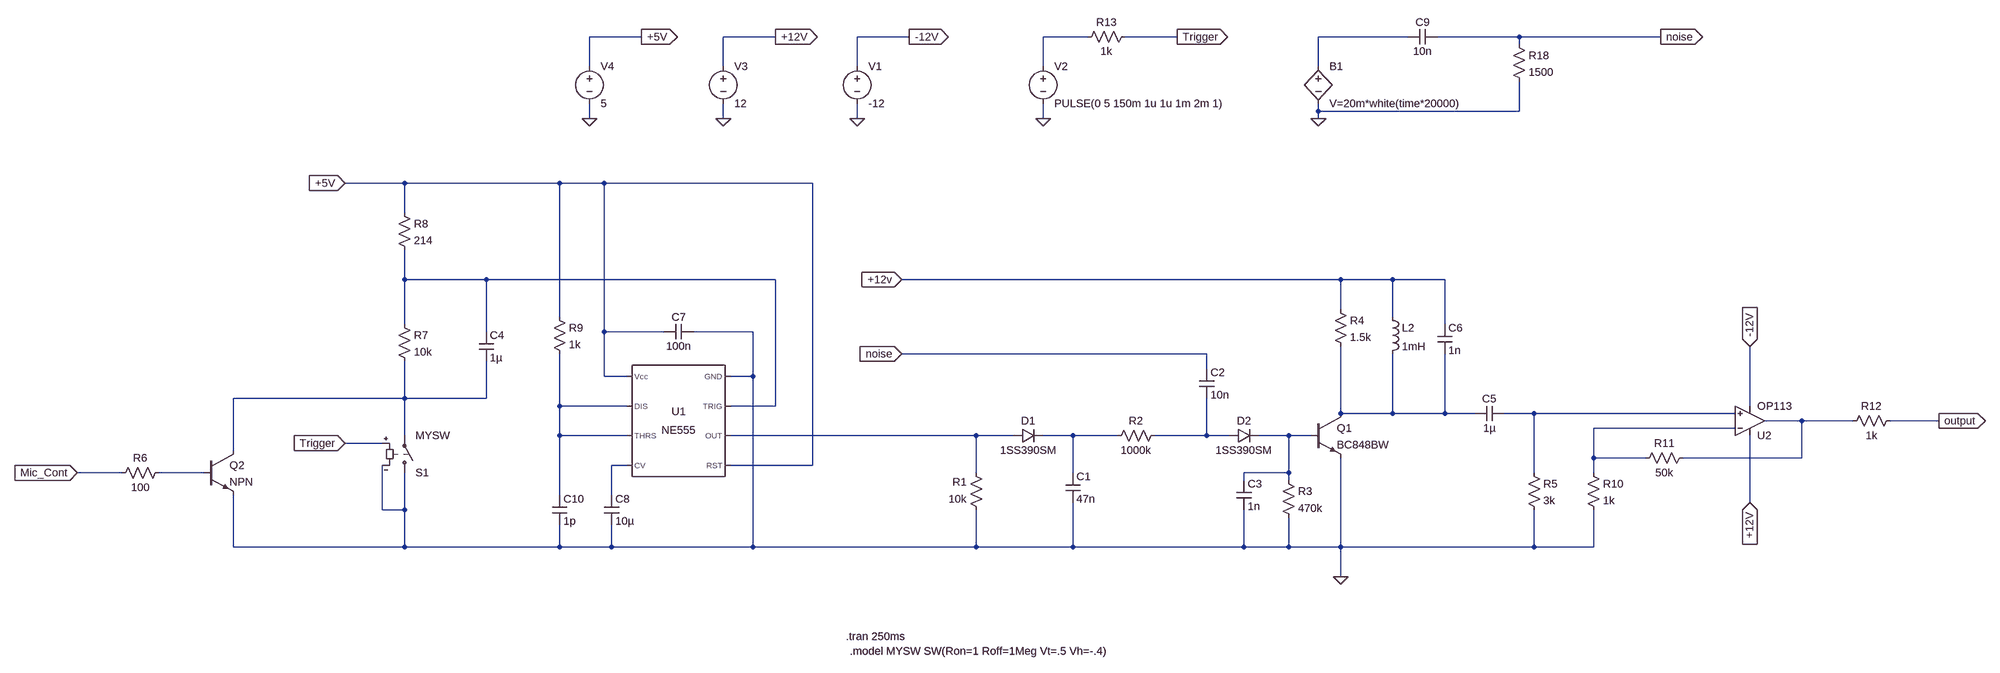
[diagram p0: schematic Platine_2.asc]
Platine_2.asc, the LTspice schematic file:
Version 4
SHEET 1 3160 680
WIRE 192 -1152 80 -1152
WIRE 480 -1152 368 -1152
WIRE 768 -1152 656 -1152
WIRE 1152 -1152 1056 -1152
WIRE 1344 -1152 1232 -1152
WIRE 1840 -1152 1648 -1152
WIRE 2080 -1152 1904 -1152
WIRE 2384 -1152 2080 -1152
WIRE 2080 -1136 2080 -1152
WIRE 80 -1088 80 -1152
WIRE 368 -1088 368 -1152
WIRE 656 -1088 656 -1152
WIRE 1056 -1088 1056 -1152
WIRE 1648 -1088 1648 -1152
WIRE 1648 -992 1648 -1008
WIRE 2080 -992 2080 -1056
WIRE 2080 -992 1648 -992
WIRE 80 -976 80 -1008
WIRE 368 -976 368 -1008
WIRE 656 -976 656 -1008
WIRE 1056 -976 1056 -1008
WIRE 1648 -976 1648 -992
WIRE -336 -672 -464 -672
WIRE 16 -672 -336 -672
WIRE 112 -672 16 -672
WIRE 560 -672 112 -672
WIRE -336 -608 -336 -672
WIRE -336 -464 -336 -528
WIRE -160 -464 -336 -464
WIRE 480 -464 -160 -464
WIRE 1696 -464 752 -464
WIRE 1808 -464 1696 -464
WIRE 1920 -464 1808 -464
WIRE 1696 -400 1696 -464
WIRE 16 -384 16 -672
WIRE 1808 -384 1808 -464
WIRE -336 -368 -336 -464
WIRE 1920 -368 1920 -464
WIRE -160 -352 -160 -464
WIRE 112 -352 112 -672
WIRE 240 -352 112 -352
WIRE 432 -352 304 -352
WIRE 1408 -304 752 -304
WIRE 1408 -272 1408 -304
WIRE 112 -256 112 -352
WIRE 160 -256 112 -256
WIRE 432 -256 432 -352
WIRE 432 -256 384 -256
WIRE -336 -208 -336 -288
WIRE -336 -208 -704 -208
WIRE -160 -208 -160 -288
WIRE -160 -208 -336 -208
WIRE 16 -192 16 -304
WIRE 160 -192 16 -192
WIRE 480 -192 480 -464
WIRE 480 -192 384 -192
WIRE 2576 -192 2576 -320
WIRE 1696 -176 1696 -320
WIRE 1808 -176 1808 -304
WIRE 1808 -176 1696 -176
WIRE 1920 -176 1920 -304
WIRE 1920 -176 1808 -176
WIRE 1984 -176 1920 -176
WIRE 2112 -176 2048 -176
WIRE 2544 -176 2112 -176
WIRE 2688 -160 2608 -160
WIRE 2816 -160 2688 -160
WIRE 3024 -160 2896 -160
WIRE 2544 -144 2240 -144
WIRE -336 -128 -336 -208
WIRE 16 -128 16 -192
WIRE 160 -128 16 -128
WIRE 912 -128 384 -128
WIRE 992 -128 912 -128
WIRE 1120 -128 1056 -128
WIRE 1216 -128 1120 -128
WIRE 1408 -128 1408 -208
WIRE 1408 -128 1296 -128
WIRE 1456 -128 1408 -128
WIRE 1584 -128 1520 -128
WIRE 1632 -128 1584 -128
WIRE -384 -112 -464 -112
WIRE -704 -96 -704 -208
WIRE 2240 -80 2240 -144
WIRE 2352 -80 2240 -80
WIRE 2688 -80 2688 -160
WIRE 2688 -80 2432 -80
WIRE 160 -64 128 -64
WIRE 560 -64 560 -672
WIRE 560 -64 384 -64
WIRE -944 -48 -1040 -48
WIRE -768 -48 -864 -48
WIRE 912 -48 912 -128
WIRE 1120 -48 1120 -128
WIRE 1584 -48 1584 -128
WIRE 1584 -48 1488 -48
WIRE 2112 -48 2112 -176
WIRE 2240 -48 2240 -80
WIRE 1488 -32 1488 -48
WIRE 1584 -32 1584 -48
WIRE 16 0 16 -128
WIRE 128 0 128 -64
WIRE 2576 16 2576 -128
WIRE -384 32 -384 -64
WIRE -336 32 -336 -48
WIRE -336 32 -384 32
WIRE -704 112 -704 0
WIRE -336 112 -336 32
WIRE -336 112 -704 112
WIRE 16 112 16 64
WIRE 16 112 -336 112
WIRE 128 112 128 64
WIRE 128 112 16 112
WIRE 432 112 432 -256
WIRE 432 112 128 112
WIRE 912 112 912 32
WIRE 912 112 432 112
WIRE 1120 112 1120 16
WIRE 1120 112 912 112
WIRE 1488 112 1488 32
WIRE 1488 112 1120 112
WIRE 1584 112 1584 48
WIRE 1584 112 1488 112
WIRE 1696 112 1696 -80
WIRE 1696 112 1584 112
WIRE 2112 112 2112 32
WIRE 2112 112 1696 112
WIRE 2240 112 2240 32
WIRE 2240 112 2112 112
WIRE 1696 176 1696 112
FLAG 768 -1152 -12V
IOPIN 768 -1152 Out
FLAG 656 -976 0
FLAG 1344 -1152 Trigger
IOPIN 1344 -1152 Out
FLAG 1056 -976 0
FLAG 752 -464 +12v
IOPIN 752 -464 In
FLAG 3024 -160 output
IOPIN 3024 -160 Out
FLAG 1648 -976 0
FLAG 2384 -1152 noise
IOPIN 2384 -1152 Out
FLAG 1696 176 0
FLAG 752 -304 noise
IOPIN 752 -304 In
FLAG -1040 -48 Mic_Cont
IOPIN -1040 -48 In
FLAG -464 -112 Trigger
IOPIN -464 -112 In
FLAG -464 -672 +5V
IOPIN -464 -672 In
FLAG 480 -1152 +12V
IOPIN 480 -1152 Out
FLAG 368 -976 0
FLAG 192 -1152 +5V
IOPIN 192 -1152 Out
FLAG 80 -976 0
FLAG 2576 -320 -12V
IOPIN 2576 -320 In
FLAG 2576 16 +12V
IOPIN 2576 16 In
SYMBOL voltage 656 -1104 R0
WINDOW 123 0 0 Left 0
WINDOW 39 0 0 Left 0
SYMATTR InstName V1
SYMATTR Value -12
SYMBOL voltage 1056 -1104 R0
WINDOW 123 0 0 Left 0
WINDOW 39 0 0 Left 0
SYMATTR InstName V2
SYMATTR Value PULSE(0 5 150m 1u 1u 1m 2m 1)
SYMBOL bv 1648 -1104 R0
SYMATTR InstName B1
SYMATTR Value V=20m*white(time*20000)
SYMBOL cap 1904 -1168 R90
WINDOW 0 0 32 VBottom 2
WINDOW 3 32 32 VTop 2
SYMATTR InstName C9
SYMATTR Value 10n
SYMBOL res 2064 -1152 R0
SYMATTR InstName R18
SYMATTR Value 1500
SYMBOL res 928 48 R180
WINDOW 0 36 76 Left 2
WINDOW 3 36 40 Left 2
SYMATTR InstName R1
SYMATTR Value 10k
SYMBOL diode 992 -112 R270
WINDOW 0 32 32 VTop 2
WINDOW 3 0 32 VBottom 2
SYMATTR InstName D1
SYMATTR Value 1SS390SM
SYMBOL cap 1104 -48 R0
SYMATTR InstName C1
SYMATTR Value 47n
SYMBOL res 1312 -144 R90
WINDOW 0 0 56 VBottom 2
WINDOW 3 32 56 VTop 2
SYMATTR InstName R2
SYMATTR Value 1000k
SYMBOL cap 1392 -272 R0
SYMATTR InstName C2
SYMATTR Value 10n
SYMBOL diode 1456 -112 R270
WINDOW 0 32 32 VTop 2
WINDOW 3 0 32 VBottom 2
SYMATTR InstName D2
SYMATTR Value 1SS390SM
SYMBOL res 1568 -48 R0
SYMATTR InstName R3
SYMATTR Value 470k
SYMBOL cap 1472 -32 R0
SYMATTR InstName C3
SYMATTR Value 1n
SYMBOL npn 1632 -176 R0
SYMATTR InstName Q1
SYMATTR Value BC848BW
SYMBOL res 1680 -416 R0
SYMATTR InstName R4
SYMATTR Value 1.5k
SYMBOL cap 2048 -192 R90
WINDOW 0 0 32 VBottom 2
WINDOW 3 32 32 VTop 2
SYMATTR InstName C5
SYMATTR Value 1µ
SYMBOL ind 1792 -400 R0
SYMATTR InstName L2
SYMATTR Value 1mH
SYMBOL cap 1904 -368 R0
SYMATTR InstName C6
SYMATTR Value 1n
SYMBOL res -848 -64 R90
WINDOW 0 0 56 VBottom 2
WINDOW 3 32 56 VTop 2
SYMATTR InstName R6
SYMATTR Value 100
SYMBOL npn -768 -96 R0
SYMATTR InstName Q2
SYMBOL sw -336 -32 M180
SYMATTR InstName S1
SYMATTR Value MYSW
SYMBOL res -352 -384 R0
SYMATTR InstName R7
SYMATTR Value 10k
SYMBOL res -352 -624 R0
SYMATTR InstName R8
SYMATTR Value 214
SYMBOL cap -176 -352 R0
SYMATTR InstName C4
SYMATTR Value 1µ
SYMBOL Misc\\NE555 272 -160 M0
SYMATTR InstName U1
SYMBOL res 0 -400 R0
SYMATTR InstName R9
SYMATTR Value 1k
SYMBOL cap 304 -368 R90
WINDOW 0 0 32 VBottom 2
WINDOW 3 32 32 VTop 2
SYMATTR InstName C7
SYMATTR Value 100n
SYMBOL cap 112 0 R0
SYMATTR InstName C8
SYMATTR Value 10µ
SYMBOL cap 0 0 R0
SYMATTR InstName C10
SYMATTR Value 1p
SYMBOL voltage 368 -1104 R0
WINDOW 123 0 0 Left 0
WINDOW 39 0 0 Left 0
SYMATTR InstName V3
SYMATTR Value 12
SYMBOL voltage 80 -1104 R0
WINDOW 123 0 0 Left 0
WINDOW 39 0 0 Left 0
SYMATTR InstName V4
SYMATTR Value 5
SYMBOL res 2096 -64 R0
SYMATTR InstName R5
SYMATTR Value 3k
SYMBOL OpAmps\\OP113 2576 -96 M180
SYMATTR InstName U2
SYMBOL res 2224 -64 R0
SYMATTR InstName R10
SYMATTR Value 1k
SYMBOL res 2448 -96 R90
WINDOW 0 0 56 VBottom 2
WINDOW 3 32 56 VTop 2
SYMATTR InstName R11
SYMATTR Value 50k
SYMBOL res 2912 -176 R90
WINDOW 0 0 56 VBottom 2
WINDOW 3 32 56 VTop 2
SYMATTR InstName R12
SYMATTR Value 1k
SYMBOL res 1248 -1168 R90
WINDOW 0 0 56 VBottom 2
WINDOW 3 32 56 VTop 2
SYMATTR InstName R13
SYMATTR Value 1k
TEXT 632 304 Left 2 !.tran 250ms
TEXT 640 336 Left 2 !.model MYSW SW(Ron=1 Roff=1Meg Vt=.5 Vh=-.4)

The netlist it stands for:
* Platine_2.asc
V1 -12V 0 -12
V2 N001 0 PULSE(0 5 150m 1u 1u 1m 2m 1)
B1 N002 0 V=20m*white(time*20000)
C9 noise N002 10n
R18 noise 0 1500
R1 0 N010 10k
D1 N010 N011 1SS390SM
C1 N011 0 47n
R2 N012 N011 1000k
C2 noise N012 10n
D2 N012 N013 1SS390SM
R3 N013 0 470k
C3 N013 0 1n
Q1 N006 N013 0 0 BC848BW
R4 +12v N006 1.5k
C5 N007 N006 1µ
L2 +12v N006 1mH
C6 +12v N006 1n
R6 N015 Mic_Cont 100
Q2 N004 N015 0 0 NPN
S1 0 N004 Trigger 0 MYSW
R7 N003 N004 10k
R8 +5V N003 214
C4 N003 N004 1µ
XU1 0 N003 N010 +5V N014 N005 N005 +5V NE555  ; pins GND TRIG OUT RST CV THRS DIS Vcc
R9 +5V N005 1k
C7 0 +5V 100n
C8 N014 0 10µ
C10 N005 0 1p
V3 +12v 0 12
V4 +5V 0 5
R5 N007 0 3k
XU2 N007 N009 +12v -12V N008 OP113  ; pins In+ In- V+ V- OUT
R10 N009 0 1k
R11 N008 N009 50k
R12 output N008 1k
R13 Trigger N001 1k
.model D D
.lib standard.dio
.model NPN NPN
.model PNP PNP
.lib standard.bjt
.tran 250ms
.model MYSW SW(Ron=1 Roff=1Meg Vt=.5 Vh=-.4)
.lib NE555.sub
.lib ADI.lib
.backanno
.end